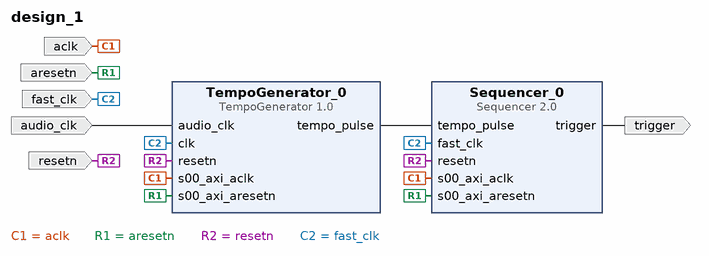
[diagram p0: block diagram of the top level]
# Vivado block design design_1, xc7a200tsbg484-1, Vivado 2018.3.1
create_bd_design design_1

create_bd_port -dir O trigger
create_bd_port -dir I -type clk aclk
create_bd_port -dir I -type rst aresetn
create_bd_port -dir I -type clk fast_clk
create_bd_port -dir I -type clk audio_clk
set_property -dict {CONFIG.FREQ_HZ 48000} [get_bd_ports audio_clk]
create_bd_port -dir I -type rst resetn

create_bd_cell -type ip -vlnv utoronto.ca:user:Sequencer:2.0 Sequencer_0
create_bd_cell -type ip -vlnv utoronto.ca:user:TempoGenerator:1.0 TempoGenerator_0
set_property -dict {CONFIG.TEMPO_RATE_DEFAULT_VALUE 0} [get_bd_cells TempoGenerator_0]

# ---- connections ----

connect_bd_net -net audio_clk_0_1 [get_bd_ports audio_clk] [get_bd_pins TempoGenerator_0/audio_clk]
connect_bd_net [get_bd_pins TempoGenerator_0/tempo_pulse] [get_bd_pins Sequencer_0/tempo_pulse]
connect_bd_net [get_bd_ports aclk] [get_bd_pins Sequencer_0/s00_axi_aclk] [get_bd_pins TempoGenerator_0/s00_axi_aclk]
connect_bd_net [get_bd_ports aresetn] [get_bd_pins Sequencer_0/s00_axi_aresetn] [get_bd_pins TempoGenerator_0/s00_axi_aresetn]
connect_bd_net [get_bd_ports resetn] [get_bd_pins Sequencer_0/resetn] [get_bd_pins TempoGenerator_0/resetn]
connect_bd_net [get_bd_ports fast_clk] [get_bd_pins Sequencer_0/fast_clk] [get_bd_pins TempoGenerator_0/clk]
connect_bd_net [get_bd_pins Sequencer_0/trigger] [get_bd_ports trigger]

validate_bd_design
save_bd_design
